# Altium schematic sheet Khoi_Nguon.SchDoc
size A4; SheetNumber: 5; SheetTotal: 6
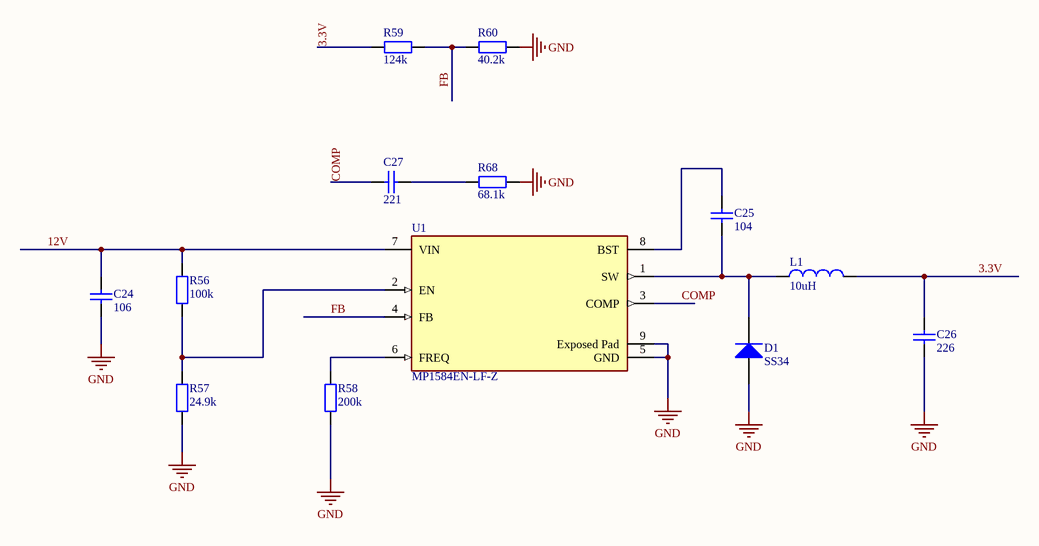
[diagram p0: Khoi_Nguon.SchDoc]

## Parts
C24  106  [tu 0805]
C25  104  [tu 0805]
C26  226  [tu 0805]
C27  221  [tu 0805]
D1  SS34  [DIODE SMA]
L1  10uH  [SUMI-CDRH127_V]
R56  100k  [tro smd 0805]
R57  24.9k  [tro smd 0805]
R58  200k  [tro smd 0805]
R59  124k  [tro smd 0805]
R60  40.2k  [tro smd 0805]
R68  68.1k  [tro smd 0805]
U1  MP1584EN-LF-Z  [FP-MP1584EN-LF-Z-MFG]

## Nets
GND: C24.2 C26.2 D1.1(A) R57.2 R58.2 R60.2 R68.2 U1.5(GND) U1.9(Exposed_Pad)
3.3V: C26.1 L1.2 R59.1
12V: C24.1 R56.1 U1.7(VIN)
COMP: C27.1 U1.3(COMP)
FB: R59.2 R60.1 U1.4(FB)
NetC25_1: C25.1 U1.8(BST)
NetC25_2: C25.2 D1.2(K) L1.1 U1.1(SW)
NetC27_2: C27.2 R68.1
NetR56_2: R56.2 R57.1 U1.2(EN)
NetR58_1: R58.1 U1.6(FREQ)

## Library data of the parts
C24 = Tu 0805 106 16V 10%: Dán; Ten_Linh_Kien: Tụ 0805 106-10uF 10% 16V; So_Chan: 2; Don_Vi: Con; Ma_Hang: MH004553; Chung_Loai: Dán; Kieu_Chan: *
C25 C26 = Tu 0805 104 50V 10%: Dán; Don_Vi: Con; So_Chan: 2; Ten_Linh_Kien: Tụ 0805 104-100nF 10% 50V; Ma_Hang: MH004551; Chung_Loai: Dán; Kieu_Chan: *
C27 = Tu 0805 222 50V 10%: Dán; Don_Vi: Con; So_Chan: 2; Ten_Linh_Kien: Tụ 0805 222-2.2nF 10% 50V; Ma_Hang: MH004557; Chung_Loai: Dán; Kieu_Chan: *
D1 = Diode SS34 ( 1N5822 ): Dán; Don_Vi: Con; Ma_Hang: MH002104; Ten_Linh_Kien: Diode SS34 3A 40V SMA ( 1N5822 SS34A); Kieu_Chan: *; Chung_Loai: Dán
L1 = CMP-2000-06084-1: Power Inductor, 10 uH, +/- 20%, -40 to 100 degC, 2-Pin SMD, RoHS, Tape and Reel; Manufacturer: Sumida; Catalog Drawings: CDRH127SeriesFrontCDRH127SeriesSideCDRH127SeriesBottom; Product Training Modules: PowerInductorBasics; Current Rating: 5.4A; Shielding: Shielded; Online Catalog: CDRHSeries; DC Resistance (DCR): 21.6mOhmMax; Other Names: 308-1457-1; Inductance: 10µH; Frequency - Test: 1kHz; Mounting Type: SurfaceMount; Datasheet Version: 01/2014; Package Description: 2-Pin Surface Mount Device, Body 12 x 12 mm; Frequency - Self Resonant: -; Package Reference: CDRH127; Category: Inductors,Coils,Chokes; Material - Core: -; Q @ Freq: -; Type: -; Family: FixedInductors; Ratings: -; Series: CDRH127; Manufacturer URL: http://www.sumida.com/; Operating Temperature: -40°C~100°C; Height - Seated (Max): 0.315"(8.00mm); Standard Package: 1; Size / Dimension: 0.472"Lx0.472"W(12.00mmx12.00mm); Current - Saturation: -; Datasheet URL: http://products.sumida.com/products/pdf/CDRH127.pdf; Package / Case: Nonstandard; Tolerance: ±20%; Mounting Technology: SurfaceMount; Packaging: CutTape(CT)
R56-R60 R68 = Tro 0805 1% 2k: Dán; Don_Vi: Con; So_Chan: 2; Ten_Linh_Kien: Trở 0805 1% 2k; Ma_Hang: MH005471; Chung_Loai: Dán; Kieu_Chan: *
U1 = CMP-57379-000006-1: IC REG BUCK ADJ 3A; Manufacturer: Monolithic Power Systems; Output Type: AdjustableProgrammable; Nominal Supply Current: 100uA; Switching Frequency: 100-1500kHz; Max Power Dissipation: 2.5W; Output Voltage: 0.8-25V; Max Junction Temp: +125°C; Min Supply Voltage: 4.5V; Max Supply Voltage: 28V; Number Of Outputs: 1; Standoff Height: 0mm; ComponentLink2URL: https://www.monolithicpower.com/en/documentview/productdocument/index/doc_url/L01QMTU4NF9yMS4wLnBkZg%3D%3D/release_date/MjAwOS0wNC0wOSAwMDowMDowMA%3D%3D/; Lead Free: Yes; Package: MP1584EN-LF-Z; Temperature Range Low: -20°C; Temperature: -20°C to +125°C; Height: 1.7mm; Ambient Temperature Range Low: -20°C; RoHS: TRUE; Automotive: No; Ipc Land Pattern Name: SOIC127P600X150-8; Ambient Temperature Range High: +85°C; Device Class L2: Power Management ICs; ComponentLink2Description: Datasheet; Manufacturer Part Number: MP1584EN-LF-Z; Device Class L3: Voltage Regulators - Switching; Octopart: https://octopart.com/mp1584en-lf-z-monolithic+power+systems-18629680; Category: IC; Output Current: 3A; Digikey Description: IC REG BUCK ADJ 3A; Temperature Range High: +125°C; Device Class L1: Integrated Circuits (ICs); Switching Topology: Buck